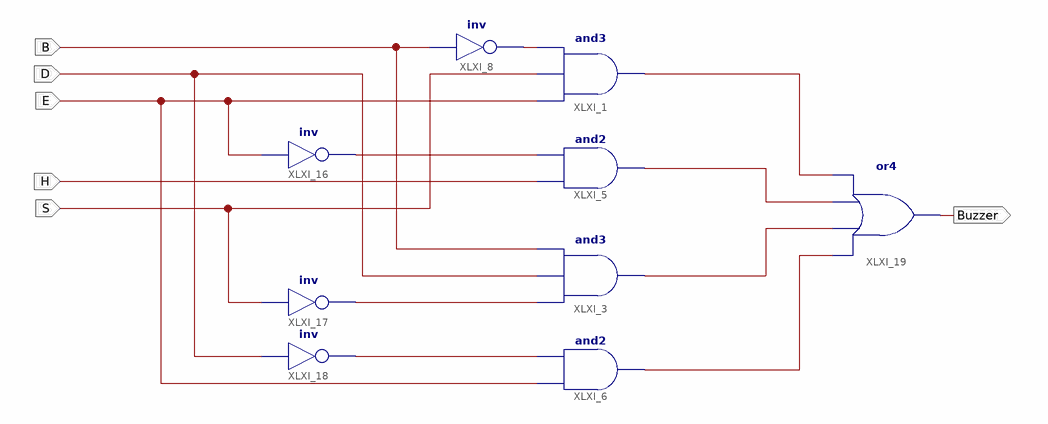
[diagram p0: schematic sheet 1]
// Xilinx ISE schematic LAB05_02.sch (spartan6) as structural Verilog: 9 symbols, 6 ports
module LAB05_02 (
  input  B,
  input  D,
  input  E,
  input  H,
  input  S,
  output Buzzer
);

  wire XLXN_2, XLXN_8, XLXN_14, XLXN_16, XLXN_21, XLXN_23, XLXN_24, XLXN_26;

  and XLXI_1 (XLXN_24, E, S, XLXN_2);
  and XLXI_3 (XLXN_23, XLXN_14, D, B);
  and XLXI_5 (XLXN_21, H, XLXN_8);
  and XLXI_6 (XLXN_26, E, XLXN_16);
  not XLXI_8 (XLXN_2, B);
  not XLXI_16 (XLXN_8, E);
  not XLXI_17 (XLXN_14, S);
  not XLXI_18 (XLXN_16, D);
  or XLXI_19 (Buzzer, XLXN_26, XLXN_23, XLXN_21, XLXN_24);
endmodule
